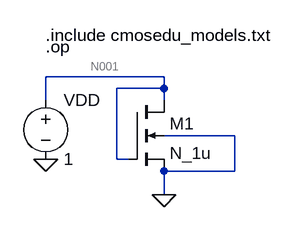
[diagram p0: schematic Parte 1.asc]
Parte 1.asc, the LTspice schematic file:
Version 4
SHEET 1 880 680
WIRE 192 80 32 80
WIRE 192 96 192 80
WIRE 192 96 128 96
WIRE 32 112 32 80
WIRE 192 112 192 96
WIRE 288 160 192 160
WIRE 128 192 128 96
WIRE 144 192 128 192
WIRE 288 208 288 160
WIRE 288 208 192 208
WIRE 192 240 192 208
FLAG 32 192 0
FLAG 192 240 0
SYMBOL voltage 32 96 R0
WINDOW 123 0 0 Left 2
WINDOW 39 0 0 Left 2
SYMATTR InstName VDD
SYMATTR Value 1
SYMBOL nmos4 144 112 R0
SYMATTR InstName M1
SYMATTR Value N_1u
SYMATTR Value2 l=1.5u w=3u
TEXT 32 24 Left 2 !.include cmosedu_models.txt
TEXT 32 40 Left 2 !.op

The netlist it stands for:
* Parte 1.asc
VDD N001 0 1
M1 N001 N001 0 0 N_1u l=1.5u w=3u
.model NMOS NMOS
.model PMOS PMOS
.lib standard.mos
.include cmosedu_models.txt
.op
.backanno
.end

* Results of the author's LTspice run, read from the files saved beside the schematic
* Operating Point:
*   V(n001) = 1 V
*   Id(M1) = 2.982 µA
*   Ig(M1) = 0 A
*   Ib(M1) = -1.01 pA
*   Is(M1) = -2.982 µA
*   I(Vdd) = -2.982 µA
* From the log:
*   Semiconductor Device Operating Points:
*                           --- MOSFET Transistors ---
*   Name:          m1
*   Model:        n_1u
*   Id:          2.98e-06
*   Vgs:         1.00e+00
*   Vds:         1.00e+00
*   Vbs:         0.00e+00
*   Vth:         8.90e-01
*   Vdsat:       1.32e-01
*   Gm:          3.43e-05
*   Gds:         1.49e-07
*   Gmb:         1.20e-05
*   Cbd:         0.00e+00
*   Cbs:         0.00e+00
*   Cgsov:       6.00e-16
*   Cgdov:       6.00e-16
*   Cgbov:       1.30e-16
*   Cgs:         4.49e-15
*   Cgd:         0.00e+00
*   Cgb:         0.00e+00